# EAGLE design PowerIOShield (EAGLE 9.3.0)
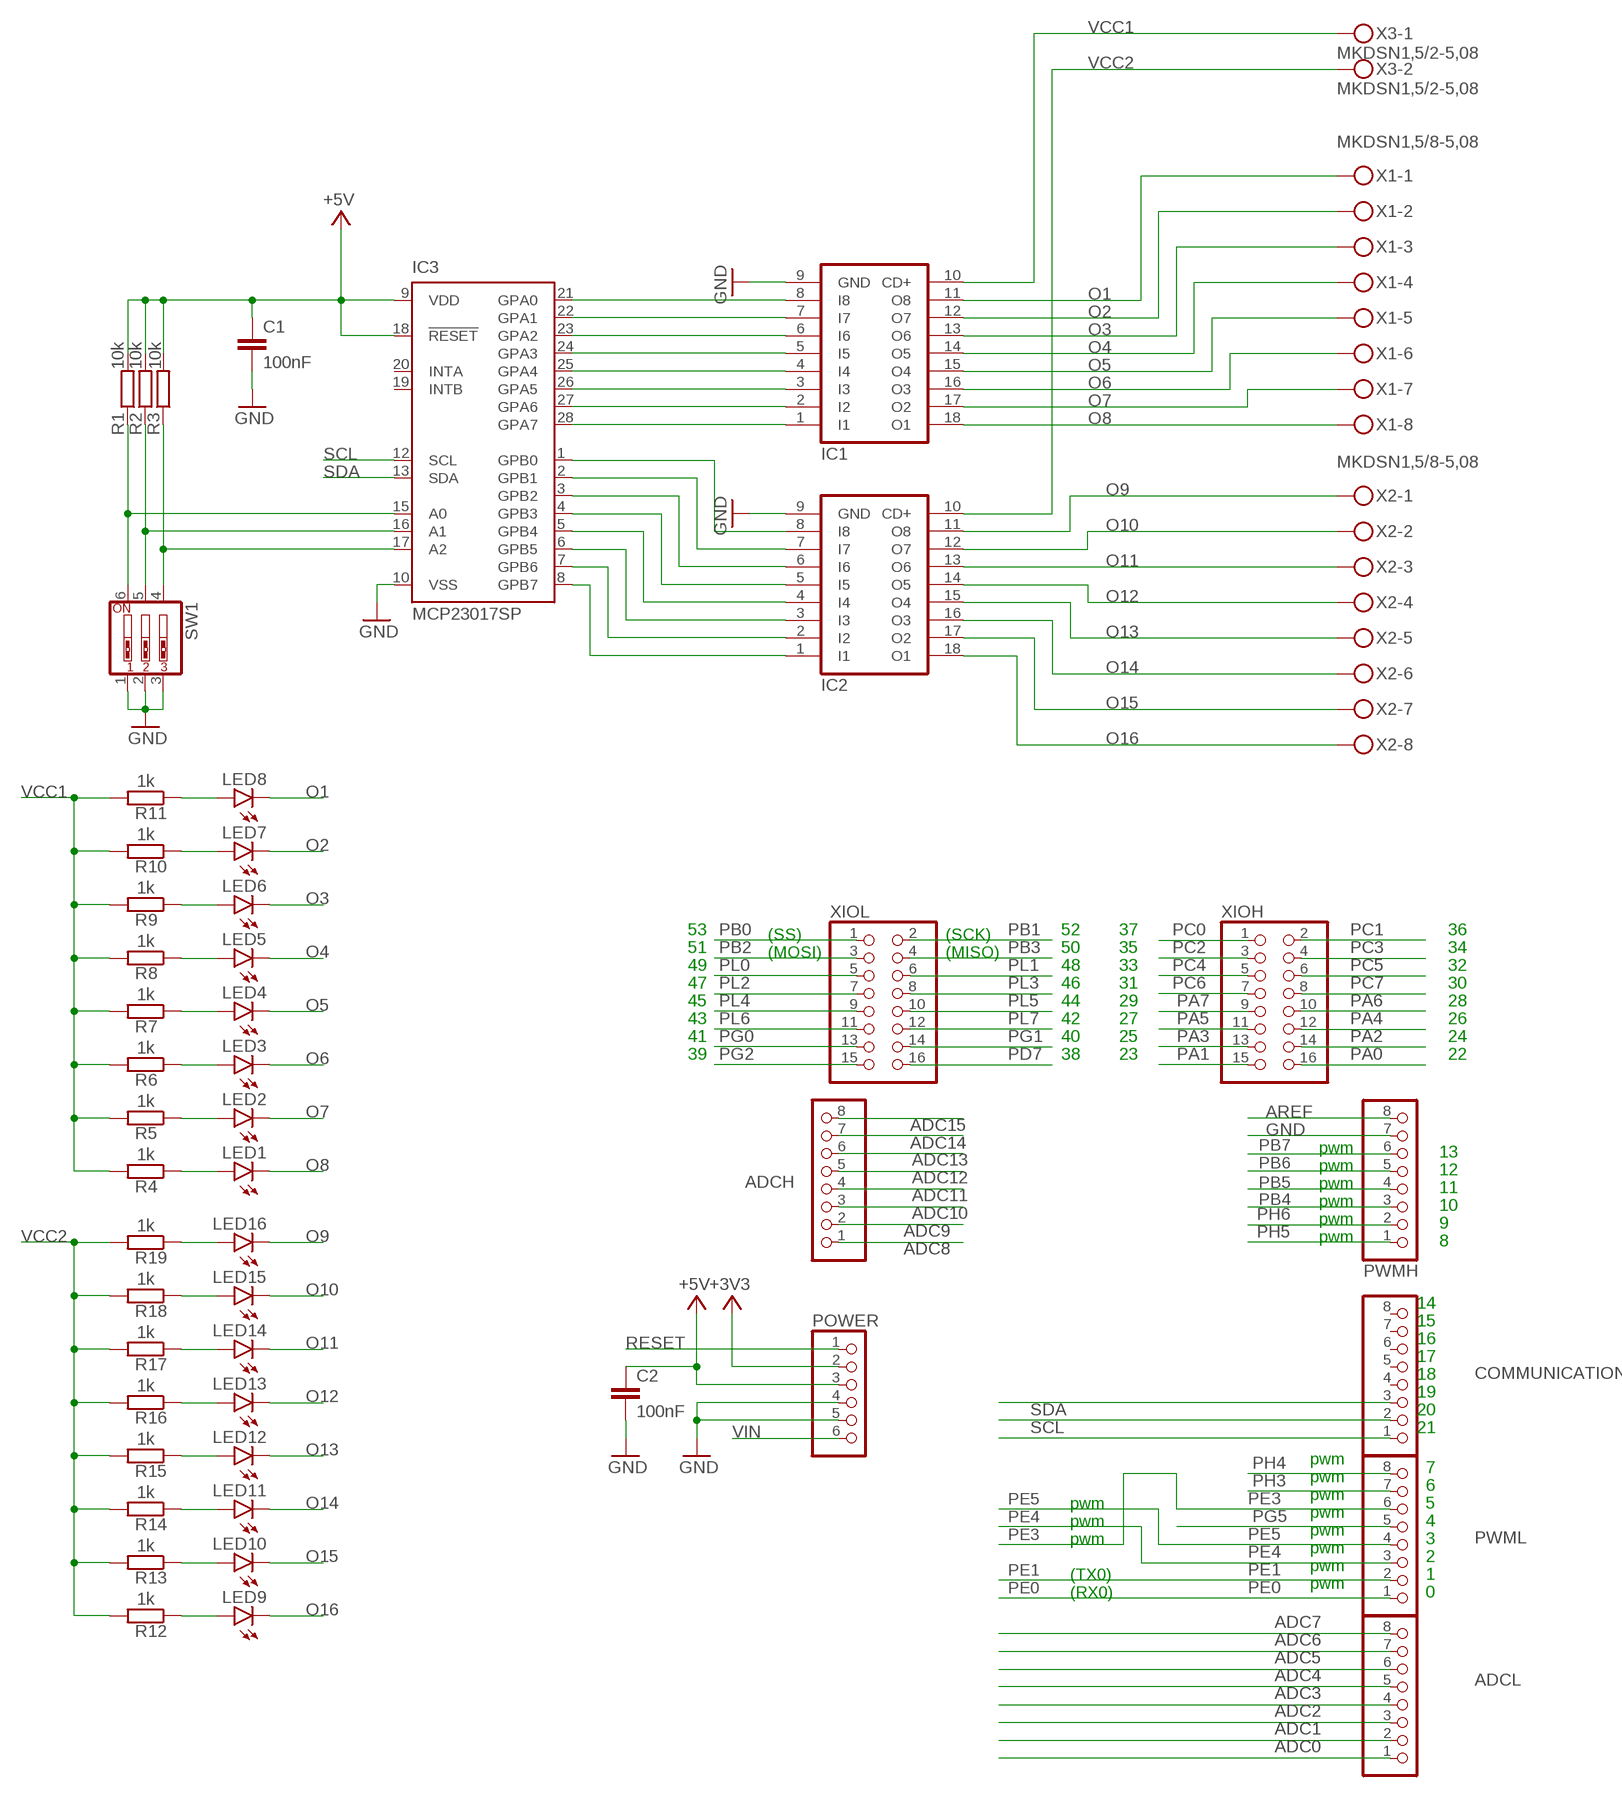
[diagram p0: schematic, sheet 1]

## Parts
ADCH  PINHD-1X8  [1X08]
ADCL  PINHD-1X8  [1X08]
C1  100nF  C-EU025-024X044  [C025-024X044]
C2  100nF  C-EU025-024X044  [C025-024X044]
COMMUNICATION  PINHD-1X8  [1X08]
IC1  ULN2803A  [DIL18]
IC2  ULN2803A  [DIL18]
IC3  MCP23017SP  [DIL28-3]
LED1  LED3MM  [LED3MM]
LED2  LED3MM  [LED3MM]
LED3  LED3MM  [LED3MM]
LED4  LED3MM  [LED3MM]
LED5  LED3MM  [LED3MM]
LED6  LED3MM  [LED3MM]
LED7  LED3MM  [LED3MM]
LED8  LED3MM  [LED3MM]
LED9  LED3MM  [LED3MM]
LED10  LED3MM  [LED3MM]
LED11  LED3MM  [LED3MM]
LED12  LED3MM  [LED3MM]
LED13  LED3MM  [LED3MM]
LED14  LED3MM  [LED3MM]
LED15  LED3MM  [LED3MM]
LED16  LED3MM  [LED3MM]
POWER  PINHD-1X6  [1X06]
PWMH  PINHD-1X8  [1X08]
PWML  PINHD-1X8  [1X08]
R1  10k  R-EU_0204/7  [0204/7]
R2  10k  R-EU_0204/7  [0204/7]
R3  10k  R-EU_0204/7  [0204/7]
R4  1k  R-EU_0204/7  [0204/7]
R5  1k  R-EU_0204/7  [0204/7]
R6  1k  R-EU_0204/7  [0204/7]
R7  1k  R-EU_0204/7  [0204/7]
R8  1k  R-EU_0204/7  [0204/7]
R9  1k  R-EU_0204/7  [0204/7]
R10  1k  R-EU_0204/7  [0204/7]
R11  1k  R-EU_0204/7  [0204/7]
R12  1k  R-EU_0204/7  [0204/7]
R13  1k  R-EU_0204/7  [0204/7]
R14  1k  R-EU_0204/7  [0204/7]
R15  1k  R-EU_0204/7  [0204/7]
R16  1k  R-EU_0204/7  [0204/7]
R17  1k  R-EU_0204/7  [0204/7]
R18  1k  R-EU_0204/7  [0204/7]
R19  1k  R-EU_0204/7  [0204/7]
SW1  SW_DIP-3  [EDG-03]
X1  MKDSN1,5/8-5,08  [MKDSN1,5/8-5,08]
X2  MKDSN1,5/8-5,08  [MKDSN1,5/8-5,08]
X3  MKDSN1,5/2-5,08  [MKDSN1,5/2-5,08]
XIOH  PINHD-2X8  [2X08]
XIOL  PINHD-2X8  [2X08]

## Nets
+3V3: POWER.2
+5V: C1.1 C2.1 IC3.9(VDD) IC3.18(!RESET) POWER.3 R1.2 R2.2 R3.2
ADC0: ADCL.1
ADC1: ADCL.2
ADC2: ADCL.3
ADC3: ADCL.4
ADC4: ADCL.5
ADC5: ADCL.6
ADC6: ADCL.7
ADC7: ADCL.8
ADC8: ADCH.1
ADC9: ADCH.2
ADC10: ADCH.3
ADC11: ADCH.4
ADC12: ADCH.5
ADC13: ADCH.6
ADC14: ADCH.7
ADC15: ADCH.8
AREF: PWMH.8
GND: C1.2 C2.2 IC1.9(GND) IC2.9(GND) IC3.10(VSS) POWER.4 POWER.5 PWMH.7 SW1.1 SW1.2 SW1.3
N$1: IC3.15(A0) R1.1 SW1.6
N$2: IC2.8(I8) IC3.1(GPB0)
N$3: IC1.1(I1) IC3.28(GPA7)
N$4: IC1.2(I2) IC3.27(GPA6)
N$5: IC1.3(I3) IC3.26(GPA5)
N$6: IC1.4(I4) IC3.25(GPA4)
N$7: IC1.5(I5) IC3.24(GPA3)
N$8: IC1.6(I6) IC3.23(GPA2)
N$9: IC1.7(I7) IC3.22(GPA1)
N$10: IC1.8(I8) IC3.21(GPA0)
N$11: IC2.7(I7) IC3.2(GPB1)
N$12: IC2.6(I6) IC3.3(GPB2)
N$13: IC2.5(I5) IC3.4(GPB3)
N$14: IC2.4(I4) IC3.5(GPB4)
N$15: IC2.3(I3) IC3.6(GPB5)
N$16: IC2.2(I2) IC3.7(GPB6)
N$17: IC2.1(I1) IC3.8(GPB7)
N$18: IC3.16(A1) R2.1 SW1.5
N$19: IC3.17(A2) R3.1 SW1.4
N$20: LED1.A R4.1
N$21: LED2.A R5.1
N$22: LED3.A R6.1
N$23: LED4.A R7.1
N$24: LED5.A R8.1
N$25: LED6.A R9.1
N$26: LED7.A R10.1
N$27: LED8.A R11.1
N$28: LED9.A R12.1
N$29: LED10.A R13.1
N$30: LED11.A R14.1
N$31: LED12.A R15.1
N$32: LED13.A R16.1
N$33: LED14.A R17.1
N$34: LED15.A R18.1
N$35: LED16.A R19.1
O1: IC1.11(O8) LED8.K(C) X1.1
O2: IC1.12(O7) LED7.K(C) X1.2
O3: IC1.13(O6) LED6.K(C) X1.3
O4: IC1.14(O5) LED5.K(C) X1.4
O5: IC1.15(O4) LED4.K(C) X1.5
O6: IC1.16(O3) LED3.K(C) X1.6
O7: IC1.17(O2) LED2.K(C) X1.7
O8: IC1.18(O1) LED1.K(C) X1.8
O9: IC2.11(O8) LED16.K(C) X2.1
O10: IC2.12(O7) LED15.K(C) X2.2
O11: IC2.13(O6) LED14.K(C) X2.3
O12: IC2.14(O5) LED13.K(C) X2.4
O13: IC2.15(O4) LED12.K(C) X2.5
O14: IC2.16(O3) LED11.K(C) X2.6
O15: IC2.17(O2) LED10.K(C) X2.7
O16: IC2.18(O1) LED9.K(C) X2.8
PA0: XIOH.16
PA1: XIOH.15
PA2: XIOH.14
PA3: XIOH.13
PA4: XIOH.12
PA5: XIOH.11
PA6: XIOH.10
PA7: XIOH.9
PB0: XIOL.1
PB1: XIOL.2
PB2: XIOL.3
PB3: XIOL.4
PB4: PWMH.3
PB5: PWMH.4
PB6: PWMH.5
PB7: PWMH.6
PC0: XIOH.1
PC1: XIOH.2
PC2: XIOH.3
PC3: XIOH.4
PC4: XIOH.5
PC5: XIOH.6
PC6: XIOH.7
PC7: XIOH.8
PD7: XIOL.16
PE0: PWML.1
PE1: PWML.2
PE3: PWML.6
PE4: PWML.3
PE5: PWML.4
PG0: XIOL.13
PG1: XIOL.14
PG2: XIOL.15
PG5: PWML.5
PH3: PWML.7
PH4: PWML.8
PH5: PWMH.1
PH6: PWMH.2
PL0: XIOL.5
PL1: XIOL.6
PL2: XIOL.7
PL3: XIOL.8
PL4: XIOL.9
PL5: XIOL.10
PL6: XIOL.11
PL7: XIOL.12
RESET: POWER.1
RXD1: COMMUNICATION.3
SCL: COMMUNICATION.1 IC3.12(SCL)
SDA: COMMUNICATION.2 IC3.13(SDA)
VCC1: IC1.10(CD+) R4.2 R5.2 R6.2 R7.2 R8.2 R9.2 R10.2 R11.2 X3.1
VCC2: IC2.10(CD+) R12.2 R13.2 R14.2 R15.2 R16.2 R17.2 R18.2 R19.2 X3.2
VIN: POWER.6
Unconnected: COMMUNICATION.4 COMMUNICATION.5 COMMUNICATION.6 COMMUNICATION.7 COMMUNICATION.8 IC3.19(INTB) IC3.20(INTA)

## Notes on the sheet
- 53 | (SS) | (SCK) | 52 | 37 | 36
- 51 | (MOSI) | (MISO) | 50 | 35 | 34
- 49 | 48 | 33 | 32
- 47 | 46 | 31 | 30
- 45 | 44 | 29 | 28
- 43 | 42 | 27 | 26
- 41 | 40 | 25 | 24
- 39 | 38 | 23 | 22
- pwm | 13
- pwm | 12
- pwm | 11
- pwm | 10
- pwm | 9
- pwm | 8
- 14
- 15
- 16
- 17
- 18
- 19
- 20
- 21
- pwm
- 7
- pwm
- 6
- pwm
- pwm | 5
- pwm
- pwm | 4
- pwm
- pwm | 3
- pwm
- 2
- pwm
- (TX0) | 1
- pwm
- (RX0) | 0

## Library data of the parts
ADCH ADCL COMMUNICATION PWMH PWML = pinhead:PINHD-1X8: PIN HEADER
C1 C2 = rcl:C-EU: CAPACITOR, European symbol; SPICEPREFIX: C
IC1 IC2 = uln-udn:ULN2803A: DRIVER ARRAY
IC3 = microchip:MCP23017: http://ww1.microchip.com/downloads/en/DeviceDoc/21952a.pdf Source: http://ww1.microchip.com/downloads/en/DeviceDoc/21952a.pdf; MF: MICROCHIP; MPN: MCP23017-E/SP; OC_FARNELL: 1332088; OC_NEWARK: 31K2959
LED1-LED16 = led:LED: LED OSRAM: - CHIPLED LG R971, LG N971, LY N971, LG Q971, LY Q971, LO R971, LY R971 LH N974, LH R974 LS Q976, LO Q976, LY Q976 LO Q996 - Hyper CHIPLED LW Q18S LB Q993, LB Q99A, LB R99A - SideLED LS A670, LO A670, LY A670, LG A670, LP A670 LB A673, LV A673, LT A673, LW A673 LH A674 LY A675 LS A676, LA A676, LO A676, LY A676, LW A676 LS A679, LY A679, LG A679 - Hyper Micro SIDELED® LS Y876, LA Y876, LO Y876, LY Y876 LT Y87S - SmartLED LW L88C, LW L88S LB L89C, LB L89S, LG L890 LS L89K, LO L89K, LY L89K LS L896, LA L896, LO L896, LY L896 - TOPLED LS T670, LO T670, LY T670, LG T670, LP T670 LSG T670, LSP T670, LSY T670, LOP T670, LYG T670 LG T671, LOG T671, LSG T671 LB T673, LV T673, LT T673, LW T673 LH T674 LS T676, LA T676, LO T676, LY T676, LB T676, LH T676, LSB T676, LW T676 LB T67C, LV T67C, LT T67C, LS T67K, LO T67K, LY T67K, LW E67C LS E67B, LA E67B, LO E67B, LY E67B, LB E67C, LV E67C, LT E67C LW T67C LS T679, LY T679, LG T679 LS T770, LO T770, LY T770, LG T770, LP T770 LB T773, LV T773, LT T773, LW T773 LH T774 LS E675, LA E675, LY E675, LS T675 LS T776, LA T776, LO T776, LY T776, LB T776 LHGB T686 LT T68C, LB T68C - Hyper Mini TOPLED® LB M676 - Mini TOPLED Santana® LG M470 LS M47K, LO M47K, LY M47K Source: http://www.osram.convergy.de LUXEON: - LUMILED® LXK2-PW12-R00, LXK2-PW12-S00, LXK2-PW14-U00, LXK2-PW14-V00 LXK2-PM12-R00, LXK2-PM12-S00, LXK2-PM14-U00 LXK2-PE12-Q00, LXK2-PE12-R00, LXK2-PE12-S00, LXK2-PE14-T00, LXK2-PE14-U00 LXK2-PB12-K00, LXK2-PB12-L00, LXK2-PB12-M00, LXK2-PB14-N00, LXK2-PB14-P00, LXK2-PB14-Q00 LXK2-PR12-L00, LXK2-PR12-M00, LXK2-PR14-Q00, LXK2-PR14-R00 LXK2-PD12-Q00, LXK2-PD12-R00, LXK2-PD12-S00 LXK2-PH12-R00, LXK2-PH12-S00 LXK2-PL12-P00, LXK2-PL12-Q00, LXK2-PL12-R00 Source: www.luxeon.com KINGBRIGHT: KA-3528ASYC Source: www.kingbright.com
POWER = pinhead:PINHD-1X6: PIN HEADER
R1-R19 = rcl:R-EU_: RESISTOR, European symbol; SPICEPREFIX: R
SW1 = special:SW_DIP-3: DIP SWITCH
X1 X2 = con-phoenix-508:MKDSN1,5/8-5,08: MKDSN 1,5/ 8-5,08 Printklemme Nennstrom: 13,5 A Nennspannung: 250 V Rastermaß: 5,08 mm Polzahl: 8 Anschlussart: Schraubanschluss Montage: Löten Anschlussrichtung Leiter/Platine: 0 ° Artikelnummer: 1729186 Source: http://eshop.phoenixcontact.com .. 1729186.pdf
X3 = con-phoenix-508:MKDSN1,5/2-5,08: MKDSN 1,5/ 2-5,08 Printklemme Nennstrom: 13,5 A Nennspannung: 250 V Rastermaß: 5,08 mm Polzahl: 2 Anschlussart: Schraubanschluss Montage: Löten Anschlussrichtung Leiter/Platine: 0 ° Artikelnummer: 1729128 Source: http://eshop.phoenixcontact.com .. 1729128.pdf
XIOH XIOL = pinhead:PINHD-2X8: PIN HEADER

## Net classes
0 default: width 0.15 mm, drill 0.3 mm, clearance 0.15 mm

## Board
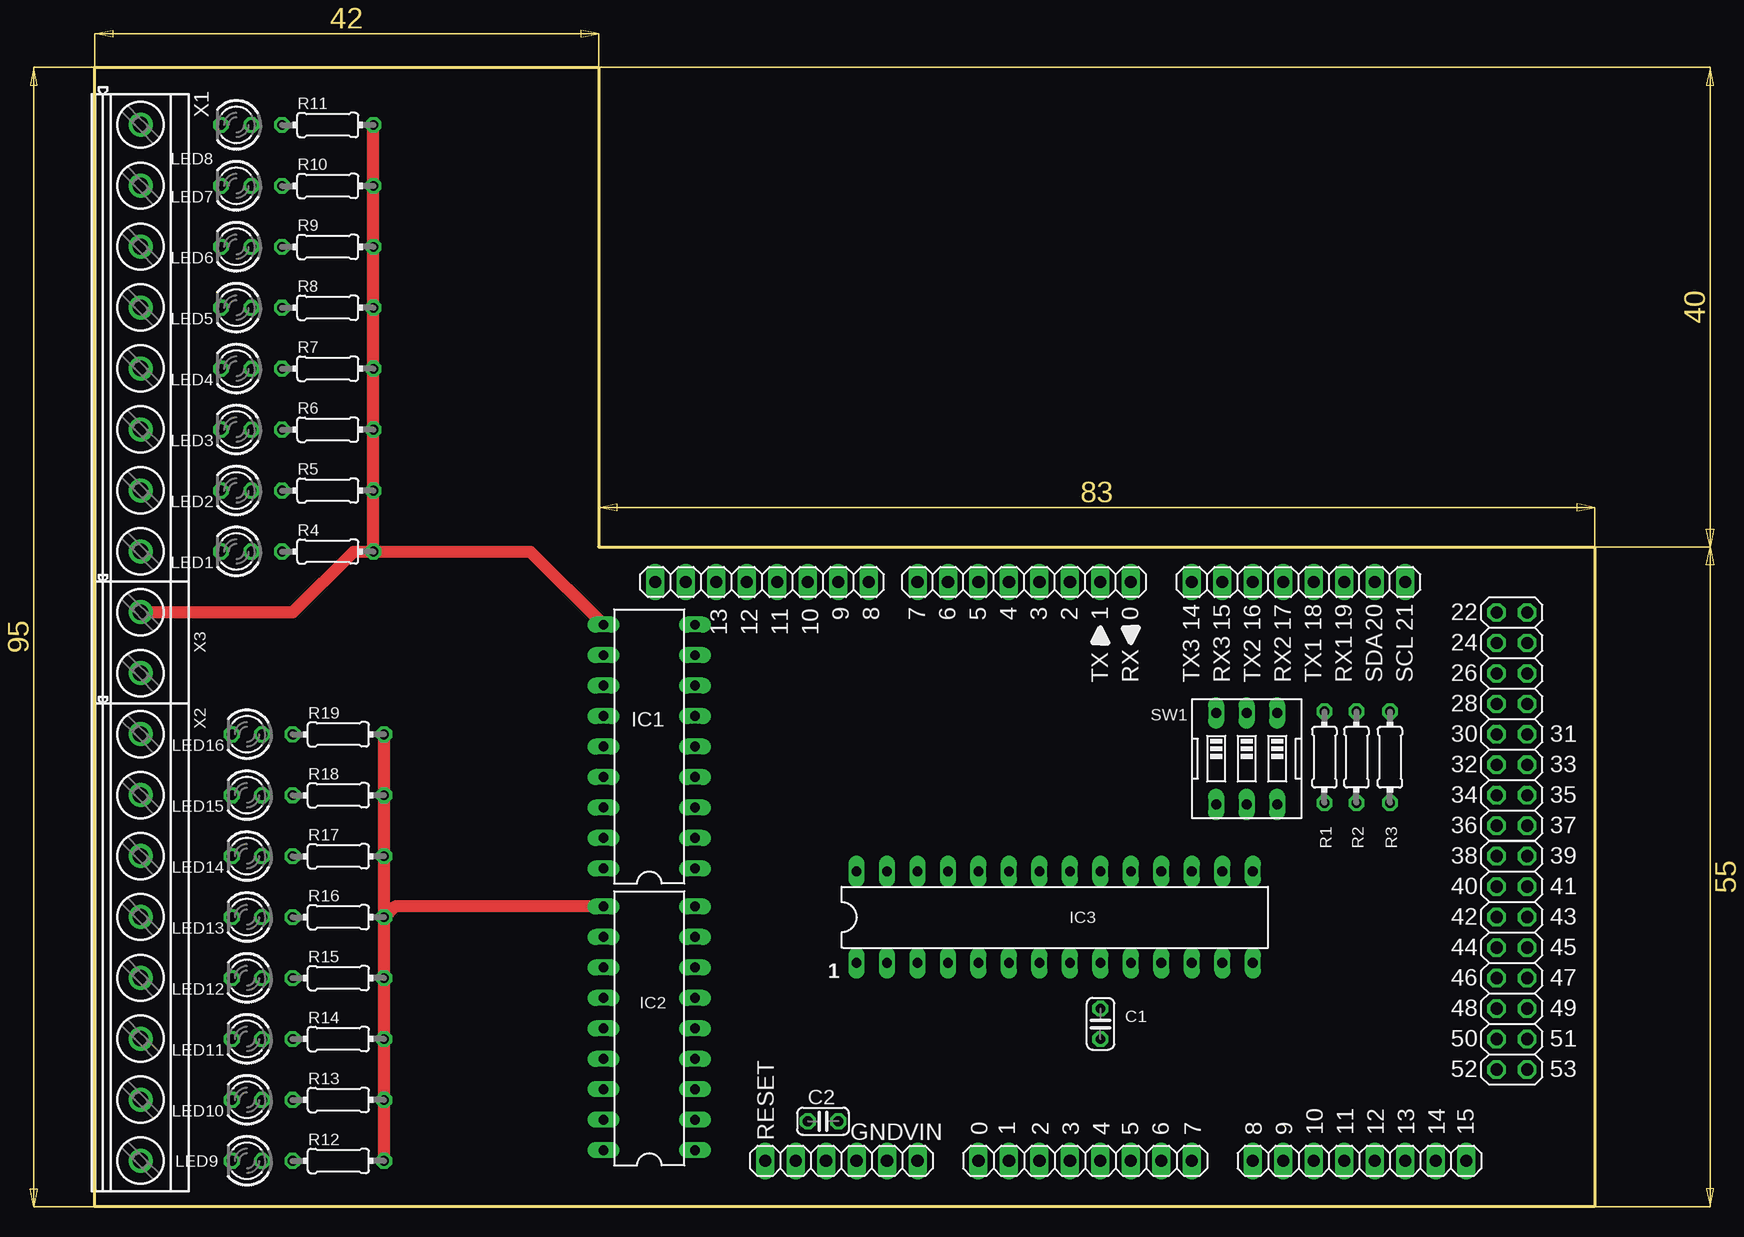
[diagram p1: board, top side]
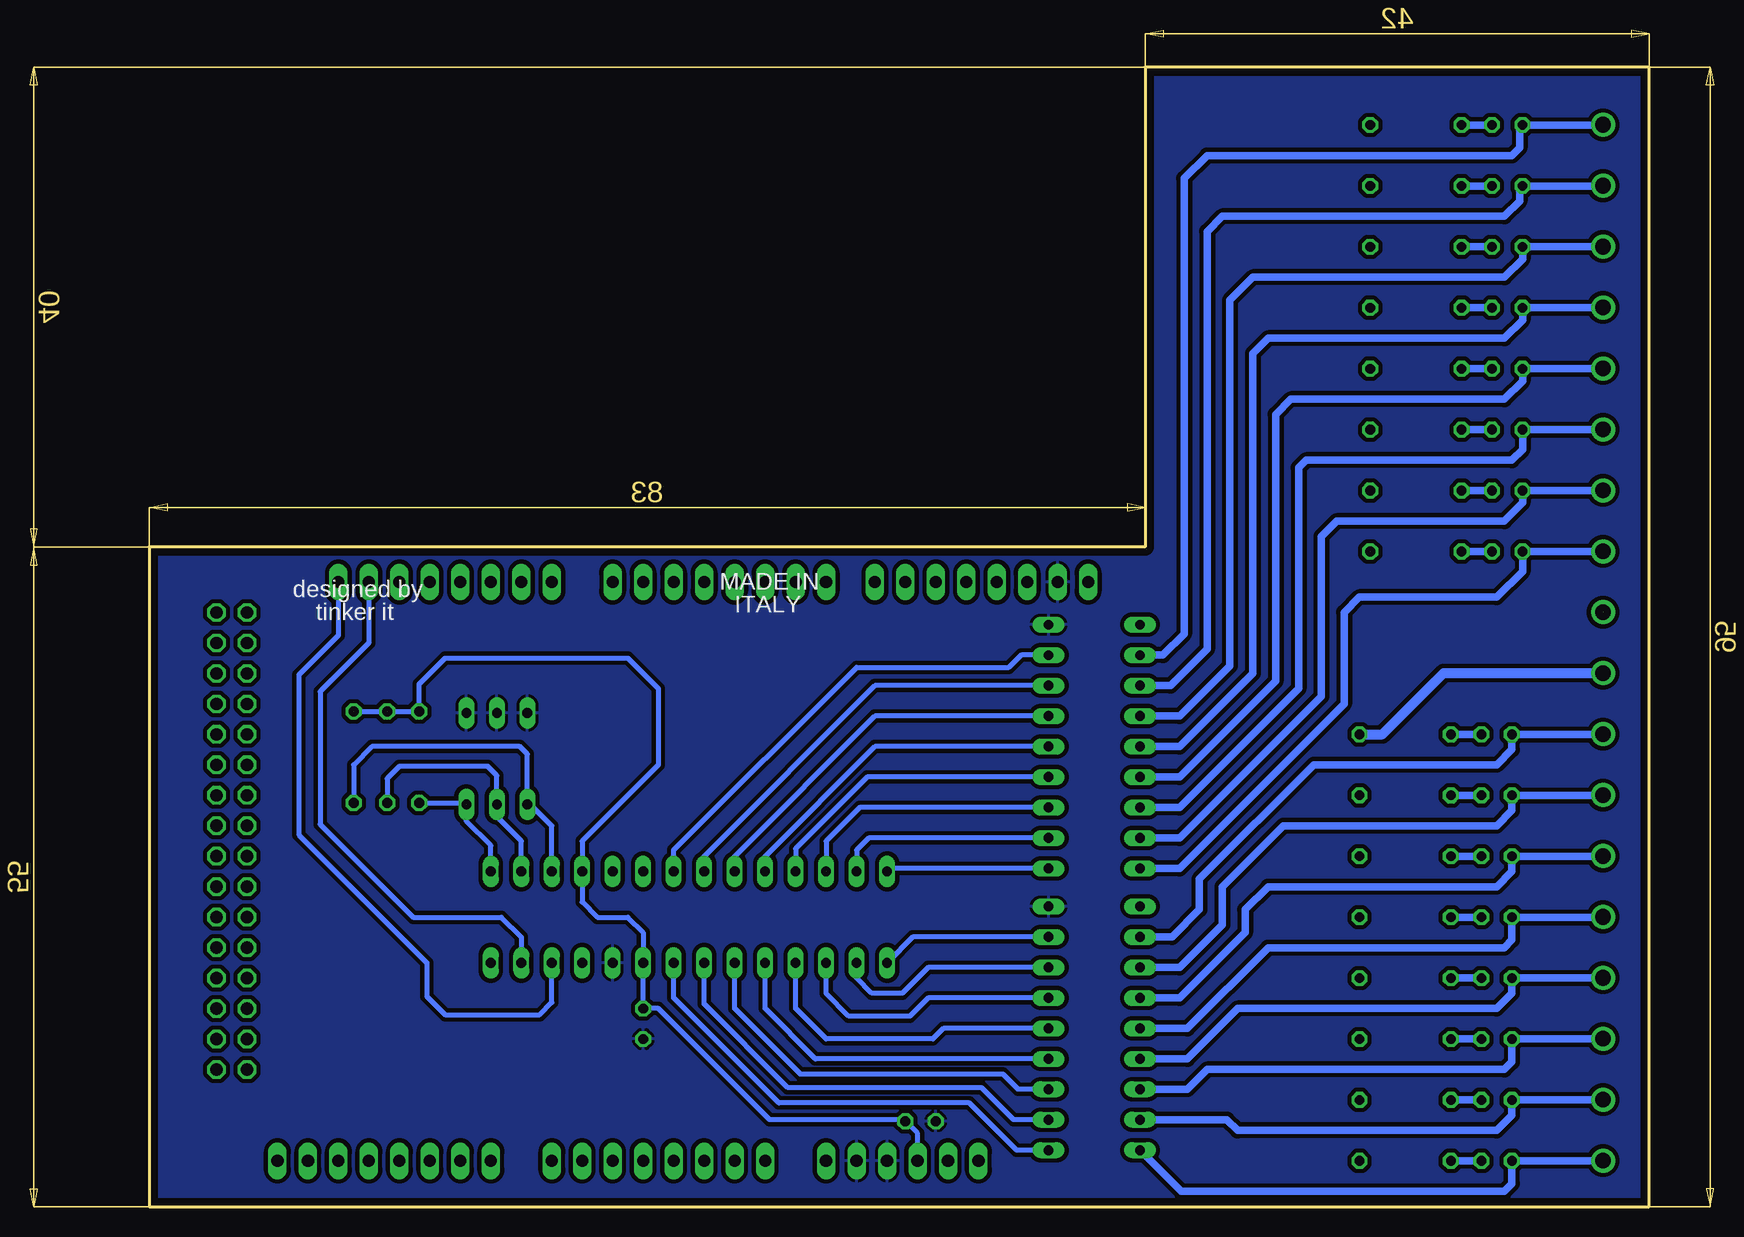
[diagram p2: board, bottom side, seen from below]

Size 125 x 95 mm. Coordinates in mm from the lower left corner, seen from the top.
Outline: 0,95 42,95 42,55 125,55 125,0 0,0 0,95
Copper layers (1*16): Top 0.035mm / dielectric 1.5mm / Bottom 0.035mm
Design rules "default *": minimum track width 0.15mm, minimum drill 0.3mm, track to track 0.15mm, track to pad 0.15mm, pad to pad 0.15mm, via to via 0.15mm, smd to smd 0.15mm, copper to edge 0.6mm, drill to drill 0.3mm, minimum pad ring 10mil, minimum via ring 10mil, stop-mask expansion 2mil, vias tented up to drill 1mil, thermal gap 10mil

### Footprints (pad centres in the part's own frame; a part is rotated, then mirrored left to right if it is on the bottom)
1X08 = drill 1.016 long: 1 -8.89,0; 2 -6.35,0; 3 -3.81,0; 4 -1.27,0; 5 1.27,0; 6 3.81,0; 7 6.35,0; 8 8.89,0
C025-024X044 = drill 0.813 octagon: 1 -1.27,0; 2 1.27,0
DIL18 = drill 0.813 long: 1 -10.16,-3.81; 2 -7.62,-3.81; 3 -5.08,-3.81; 4 -2.54,-3.81; 5 0,-3.81; 6 2.54,-3.81; 7 5.08,-3.81; 8 7.62,-3.81; 9 10.16,-3.81; 10 10.16,3.81; 11 7.62,3.81; 12 5.08,3.81; 13 2.54,3.81; 14 0,3.81; 15 -2.54,3.81; 16 -5.08,3.81; 17 -7.62,3.81; 18 -10.16,3.81
DIL28-3 = drill 0.813 long: 1 -16.51,-3.81; 2 -13.97,-3.81; 3 -11.43,-3.81; 4 -8.89,-3.81; 5 -6.35,-3.81; 6 -3.81,-3.81; 7 -1.27,-3.81; 8 1.27,-3.81; 9 3.81,-3.81; 10 6.35,-3.81; 11 8.89,-3.81; 12 11.43,-3.81; 13 13.97,-3.81; 14 16.51,-3.81; 15 16.51,3.81; 16 13.97,3.81; 17 11.43,3.81; 18 8.89,3.81; 19 6.35,3.81; 20 3.81,3.81; 21 1.27,3.81; 22 -1.27,3.81; 23 -3.81,3.81; 24 -6.35,3.81; 25 -8.89,3.81; 26 -11.43,3.81; 27 -13.97,3.81; 28 -16.51,3.81
LED3MM = drill 0.813 octagon: A -1.27,0; K 1.27,0
1X06 = drill 1.016 long: 1 -6.35,0; 2 -3.81,0; 3 -1.27,0; 4 1.27,0; 5 3.81,0; 6 6.35,0
0204/7 = drill 0.813 octagon: 1 -3.81,0; 2 3.81,0
EDG-03 = drill 0.813 long: 1 -2.54,-3.81; 2 0,-3.81; 3 2.54,-3.81; 4 2.54,3.81; 5 0,3.81; 6 -2.54,3.81
MKDSN1,5/8-5,08 = drill 1.3 pad 2: 1 -17.801,0.025; 2 -12.721,0.025; 3 -7.641,0.025; 4 -2.561,0.025; 5 2.519,0.025; 6 7.599,0.025; 7 12.679,0.025; 8 17.759,0.025
MKDSN1,5/2-5,08 = drill 1.3 pad 2: 1 -2.561,0.025; 2 2.519,0.025
2X08 = drill 1.016 octagon: 1 -8.89,-1.27; 2 -8.89,1.27; 3 -6.35,-1.27; 4 -6.35,1.27; 5 -3.81,-1.27; 6 -3.81,1.27; 7 -1.27,-1.27; 8 -1.27,1.27; 9 1.27,-1.27; 10 1.27,1.27; 11 3.81,-1.27; 12 3.81,1.27; 13 6.35,-1.27; 14 6.35,1.27; 15 8.89,-1.27; 16 8.89,1.27

### Placement (x,y rotation side)
ADCH  105.41,3.81 0 top
ADCL  82.55,3.81 0 top
C1  83.82,15.24 270 top
C2  60.71,7.11 180 top
COMMUNICATION  100.33,52.07 180 top
IC1  46.23,38.35 90 top
IC2  46.23,14.86 90 top
IC3  80.01,24.13 0 top
LED1  11.81,54.61 180 top
LED2  11.81,59.69 180 top
LED3  11.81,64.77 180 top
LED4  11.81,69.85 180 top
LED5  11.81,74.93 180 top
LED6  11.81,80.01 180 top
LED7  11.81,85.09 180 top
LED8  11.81,90.17 180 top
LED9  12.7,3.81 180 top
LED10  12.7,8.89 180 top
LED11  12.7,13.97 180 top
LED12  12.7,19.05 180 top
LED13  12.7,24.13 180 top
LED14  12.7,29.21 180 top
LED15  12.7,34.29 180 top
LED16  12.7,39.37 180 top
POWER  62.23,3.81 0 top
PWMH  55.63,52.07 180 top
PWML  77.47,52.07 180 top
R1  102.49,37.47 90 top
R2  105.16,37.47 90 top
R3  107.95,37.47 90 top
R4  19.43,54.61 0 top
R5  19.43,59.69 0 top
R6  19.43,64.77 0 top
R7  19.43,69.85 0 top
R8  19.43,74.93 0 top
R9  19.43,80.01 0 top
R10  19.43,85.09 0 top
R11  19.43,90.17 0 top
R12  20.32,3.81 0 top
R13  20.32,8.89 0 top
R14  20.32,13.97 0 top
R15  20.32,19.05 0 top
R16  20.32,24.13 0 top
R17  20.32,29.21 0 top
R18  20.32,34.29 0 top
R19  20.32,39.37 0 top
SW1  96.01,37.34 180 top
X1  3.81,72.39 270 top
X2  3.81,21.59 270 top
X3  3.81,46.99 270 top
XIOH  118.11,40.64 90 top
XIOL  118.11,20.32 90 top

### Tracks (layer width: path | path; a pad name or v marks a point on that pad's centre or on a via)
+5V  (2 unrouted)
  Bottom 0.406: POWER.3 60.96,6.1 C2.1 62.1,7.24 73.28,7.24 82.55,16.51 C1.1 IC3.9 83.82,22.86 85.09,24.13 87.63,24.13 88.9,25.4 IC3.18 88.9,30.48 82.55,36.83 82.55,43.18 85.09,45.72 100.33,45.72 102.49,43.56 R1.2 R2.2 R3.2
GND
  pour Bottom (isolate 0.356, rank 2): -0.62,95.86 42.55,95.89 42.55,56.52 125.09,56.52 125.09,-0.64 -0.62,-0.64
N$1  (1 unrouted)
  Bottom 0.406: IC3.15 96.52,30.1 98.55,32.13 SW1.6 98.68,33.66 R1.1
N$2
  Bottom 0.406: IC2.8 61.34,22.48 IC3.1
N$3
  Bottom 0.406: IC1.1 63.25,28.19 IC3.28
N$4
  Bottom 0.406: IC1.2 65.02,30.73 66.04,29.72 IC3.27
N$5  (1 unrouted)
  Bottom 0.406: IC1.3 65.79,33.27 68.58,30.48 IC3.26
N$6
  Bottom 0.406: IC1.4 65.15,35.81 71.12,29.84 IC3.25
N$7
  Bottom 0.406: IC1.5 64.52,38.35 73.66,29.21 IC3.24
N$8
  Bottom 0.406: IC1.6 64.52,40.89 76.2,29.21 IC3.23
N$9
  Bottom 0.406: IC1.7 64.52,43.43 78.74,29.21 IC3.22
N$10
  Bottom 0.406: IC1.8 52.32,45.97 53.34,44.96 66.04,44.96 81.28,29.72 IC3.21
N$11
  Bottom 0.406: IC2.7 60.07,19.94 62.23,17.78 64.77,17.78 66.04,19.05 IC3.2
N$12
  Bottom 0.406: IC2.6 60.07,17.4 61.59,15.88 66.67,15.88 68.58,17.78 IC3.3
N$13
  Bottom 0.406: IC2.5 58.8,14.86 59.69,13.97 68.58,13.97 71.12,16.51 IC3.4
N$14
  Bottom 0.406: IC2.4 69.47,12.32 73.66,16.51 IC3.5
N$15
  Bottom 0.406: IC2.3 52.58,9.78 53.85,11.05 70.74,11.05 76.2,16.51 IC3.6
N$16
  Bottom 0.406: IC2.2 52.96,7.24 55.63,9.91 71.75,9.91 78.74,16.89 IC3.7
N$17
  Bottom 0.406: IC2.1 52.7,4.7 56.64,8.64 72.52,8.64 81.28,17.4 IC3.8
N$18
  Bottom 0.406: IC3.16 93.98,30.48 96.01,32.51 SW1.5 96.01,35.94 96.77,36.7 104.14,36.7 105.16,35.69 R2.1
N$19
  Bottom 0.406: IC3.17 91.44,31.75 93.22,33.53 SW1.4 93.47,37.72 94.11,38.35 106.43,38.35 107.95,36.83 R3.1
N$20
  Bottom 0.61: R4.1 LED1.A
N$21
  Bottom 0.61: R5.1 LED2.A
N$22
  Bottom 0.61: LED3.A R6.1
N$23
  Bottom 0.61: R7.1 LED4.A
N$24
  Bottom 0.61: R8.1 LED5.A
N$25
  Bottom 0.61: R9.1 LED6.A
N$26
  Bottom 0.61: R10.1 LED7.A
N$27
  Bottom 0.61: LED8.A R11.1
N$28
  Bottom 0.61: LED9.A R12.1
N$29
  Bottom 0.61: R13.1 LED10.A
N$30
  Bottom 0.61: LED11.A R14.1
N$31
  Bottom 0.61: R15.1 LED12.A
N$32
  Bottom 0.61: LED13.A R16.1
N$33
  Bottom 0.61: R17.1 LED14.A
N$34
  Bottom 0.61: LED15.A R18.1
N$35
  Bottom 0.61: LED16.A R19.1
O1
  Bottom 0.61: IC1.11 40.51,45.97 38.73,47.75 38.73,85.72 36.83,87.63 11.43,87.63 10.79,88.27 10.79,89.92 LED8.K 3.86,90.17 X1.1
O2
  Bottom 0.61: IC1.12 39.88,43.43 36.83,46.48 36.83,81.28 35.56,82.55 12.06,82.55 10.79,83.82 10.79,84.84 LED7.K 3.86,85.09 X1.2
O3
  Bottom 0.61: IC1.13 39.12,40.89 34.92,45.09 34.92,75.56 33.02,77.47 12.06,77.47 10.54,78.99 LED6.K 3.86,80.01 X1.3
O4
  Bottom 0.61: IC1.14 39.12,38.35 33.02,44.45 33.02,71.12 31.75,72.39 12.06,72.39 10.54,73.91 LED5.K 3.86,74.93 X1.4
O5
  Bottom 0.61: IC1.15 39.12,35.81 31.11,43.81 31.11,66.04 29.84,67.31 12.06,67.31 10.54,68.83 LED4.K 3.86,69.85 X1.5
O6
  Bottom 0.61: LED3.K 10.54,64.39 | IC1.16 39.12,33.27 29.21,43.18 29.21,61.59 28.57,62.23 11.43,62.23 10.54,63.12 LED3.K | LED3.K 10.52,64.79 X1.6
O7
  Bottom 0.61: IC1.17 39.12,30.73 27.3,42.55 27.3,55.88 26.04,57.15 12.06,57.15 10.54,58.67 LED2.K 10.52,59.71 X1.7
O8
  Bottom 0.61: IC1.18 39.12,28.19 25.4,41.91 25.4,49.53 24.13,50.8 12.7,50.8 10.54,52.96 LED1.K 10.52,54.63 X1.8
O9
  Bottom 0.61: IC2.11 39.75,22.48 37.47,24.77 37.47,27.3 27.94,36.83 12.7,36.83 11.43,38.1 LED16.K 3.83,39.37 X2.1
O10
  Bottom 0.61: IC2.12 39.12,19.94 35.56,23.5 35.56,26.67 30.48,31.75 12.7,31.75 11.43,33.02 LED15.K 3.86,34.29 X2.2
O11
  Bottom 0.61: IC2.13 39.12,17.4 33.66,22.86 33.66,24.77 31.75,26.67 12.7,26.67 11.43,27.94 LED14.K 3.86,29.21 X2.3
O12
  Bottom 0.61: IC2.14 38.48,14.86 31.75,21.59 12.06,21.59 11.43,22.23 LED13.K 3.86,24.13 X2.4
O13
  Bottom 0.61: IC2.15 38.48,12.32 34.29,16.51 12.7,16.51 11.43,17.78 LED12.K 3.86,19.05 X2.5
O14
  Bottom 0.61: IC2.16 38.48,9.78 36.83,11.43 12.06,11.43 11.43,12.06 LED11.K 3.86,13.97 X2.6
O15
  Bottom 0.61: IC2.17 35.18,7.24 34.29,6.35 12.7,6.35 11.43,7.62 LED10.K 3.86,8.89 X2.7
O16
  Bottom 0.61: IC2.18 38.99,1.27 12.06,1.27 11.43,1.91 LED9.K 11.41,3.83 X2.8
SCL
  Bottom 0.406: COMMUNICATION.1 109.22,47.62 112.52,44.32 112.52,30.99 101.85,20.32 101.85,17.53 100.33,16 92.46,16 91.44,17.02 IC3.12
SDA
  Bottom 0.406: COMMUNICATION.2 106.68,46.99 110.74,42.93 110.74,31.88 103,24.13 95.63,24.13 93.98,22.48 IC3.13
VCC1  (2 unrouted)
  Top 1.016: X3.1 16.53,49.55 21.59,54.61 R4.2 | R4.2 R5.2 R6.2 R7.2 R8.2 R9.2 R10.2 R11.2 | R4.2 36.32,54.61 IC1.10
VCC2
  Top 1.016: R12.2 R13.2 R14.2 R15.2 R16.2 | R16.2 R17.2 R18.2 R19.2 | IC2.10 25.02,25.02 R16.2
  Bottom 0.813: R19.2 22.23,39.37 17.12,44.47 X3.2

### Text on the board
tPlace: 9 | 8 | 7 | 6 | 5 | 4 | 3 | 2 | 1 | 0 | 22 | 13 | 12 | 11 | 10 | 14 | 15 | 16 | 17 | 18 | 19 | 20 | 21 | 24 | 26 | 28 | 30 | 31 | 32 | 33 | 34 | 35 | 36 | 37 | 38 | 39 | 40 | 41 | 42 | 43 | 44 | 45 | 46 | 47 | 48 | 49 | 50 | 51 | 52 | 53 | 0 | 1 | 2 | 3 | 4 | 5 | 6 | 7 | 8 | 9 | 10 | 11 | 12 | 13 | 14 | 15
tNames: TX | RX | TX3 | RX3 | TX2 | RX2 | TX1 | RX1 | SDA | SCL | 1 | RESET | GND | VIN
bNames: MADE IN | designed by | ITALY | tinker it
ReferenceLC: PC1 | PC2